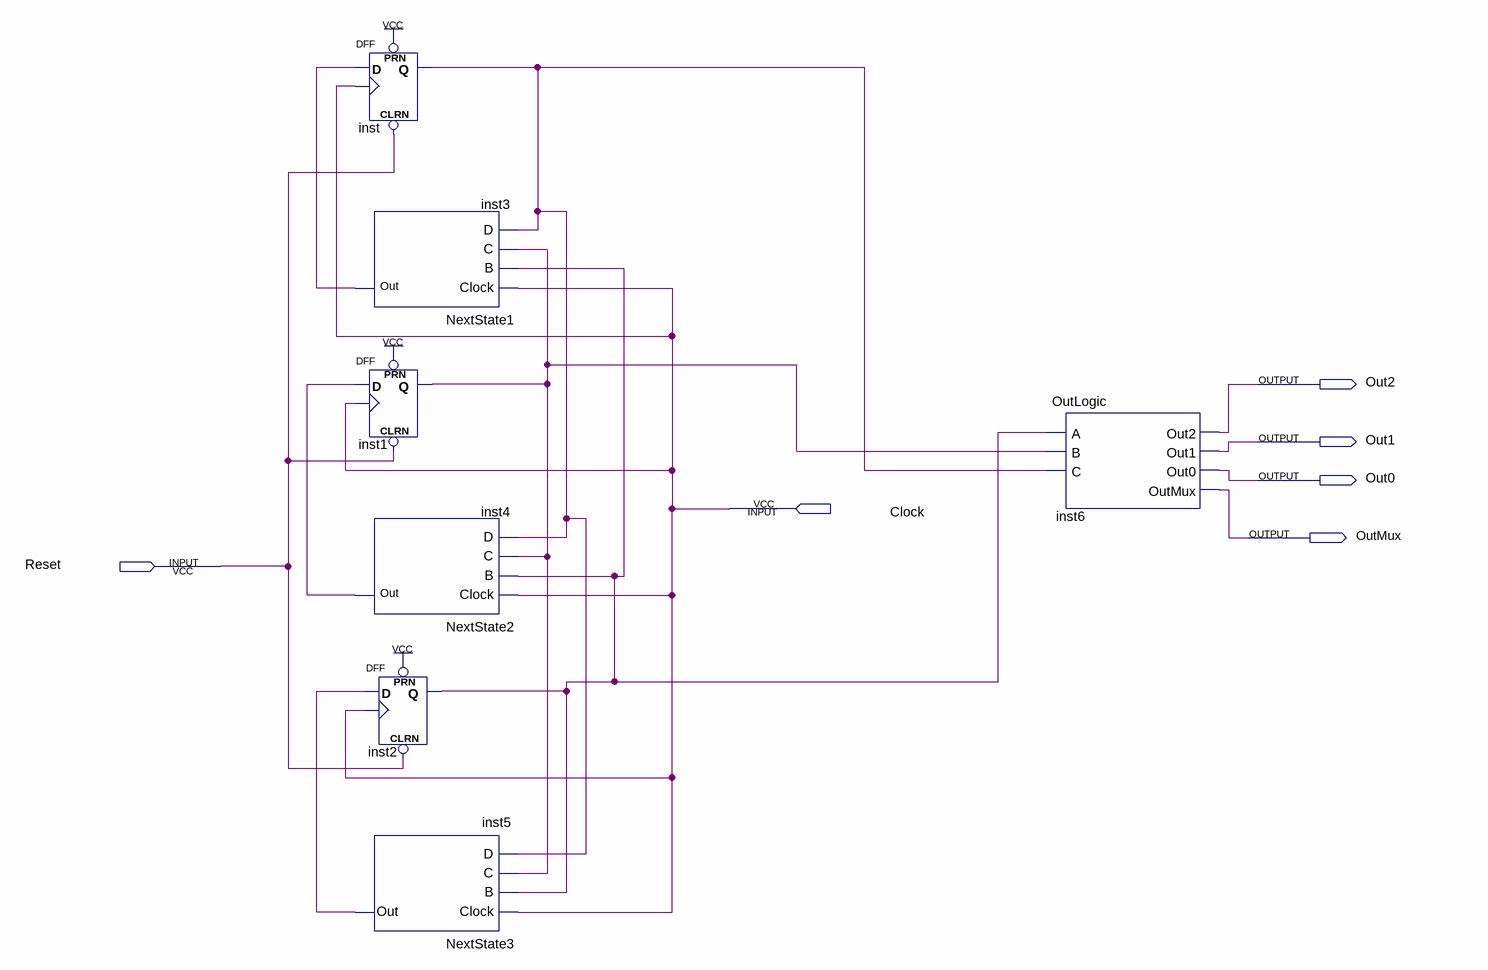
[diagram p0: schematic sheet]
// Quartus schematic StateMachine.bdf as structural Verilog: 7 symbols, 6 pins
module StateMachine (
  input  Clock,
  input  Reset,
  output Out2,
  output Out1,
  output Out0,
  output OutMux
);

  wire inst1_q, inst2_q, inst3_out, inst4_out, inst5_out, inst_q;

  DFF inst (.CLRN(Reset), .CLK(Clock), .D(inst3_out), .PRN(1'b1), .Q(inst_q));
  NextState1 inst3 (.Clock(Clock), .B(inst2_q), .C(inst1_q), .D(inst_q), .Out(inst3_out));
  DFF inst1 (.CLRN(Reset), .CLK(Clock), .D(inst4_out), .PRN(1'b1), .Q(inst1_q));
  NextState2 inst4 (.Clock(Clock), .B(inst2_q), .C(inst1_q), .D(inst_q), .Out(inst4_out));
  DFF inst2 (.CLRN(Reset), .CLK(Clock), .D(inst5_out), .PRN(1'b1), .Q(inst2_q));
  NextState3 inst5 (.Clock(Clock), .B(inst2_q), .C(inst1_q), .D(inst_q), .Out(inst5_out));
  OutLogic inst6 (.A(inst2_q), .B(inst1_q), .C(inst_q), .Out2(Out2), .Out1(Out1), .Out0(Out0), .OutMux(OutMux));
endmodule
